# EAGLE design Light_Barrier_2015_3 (EAGLE 7.3.0)
Assembly variants: X4

## Sheet 1 of 3
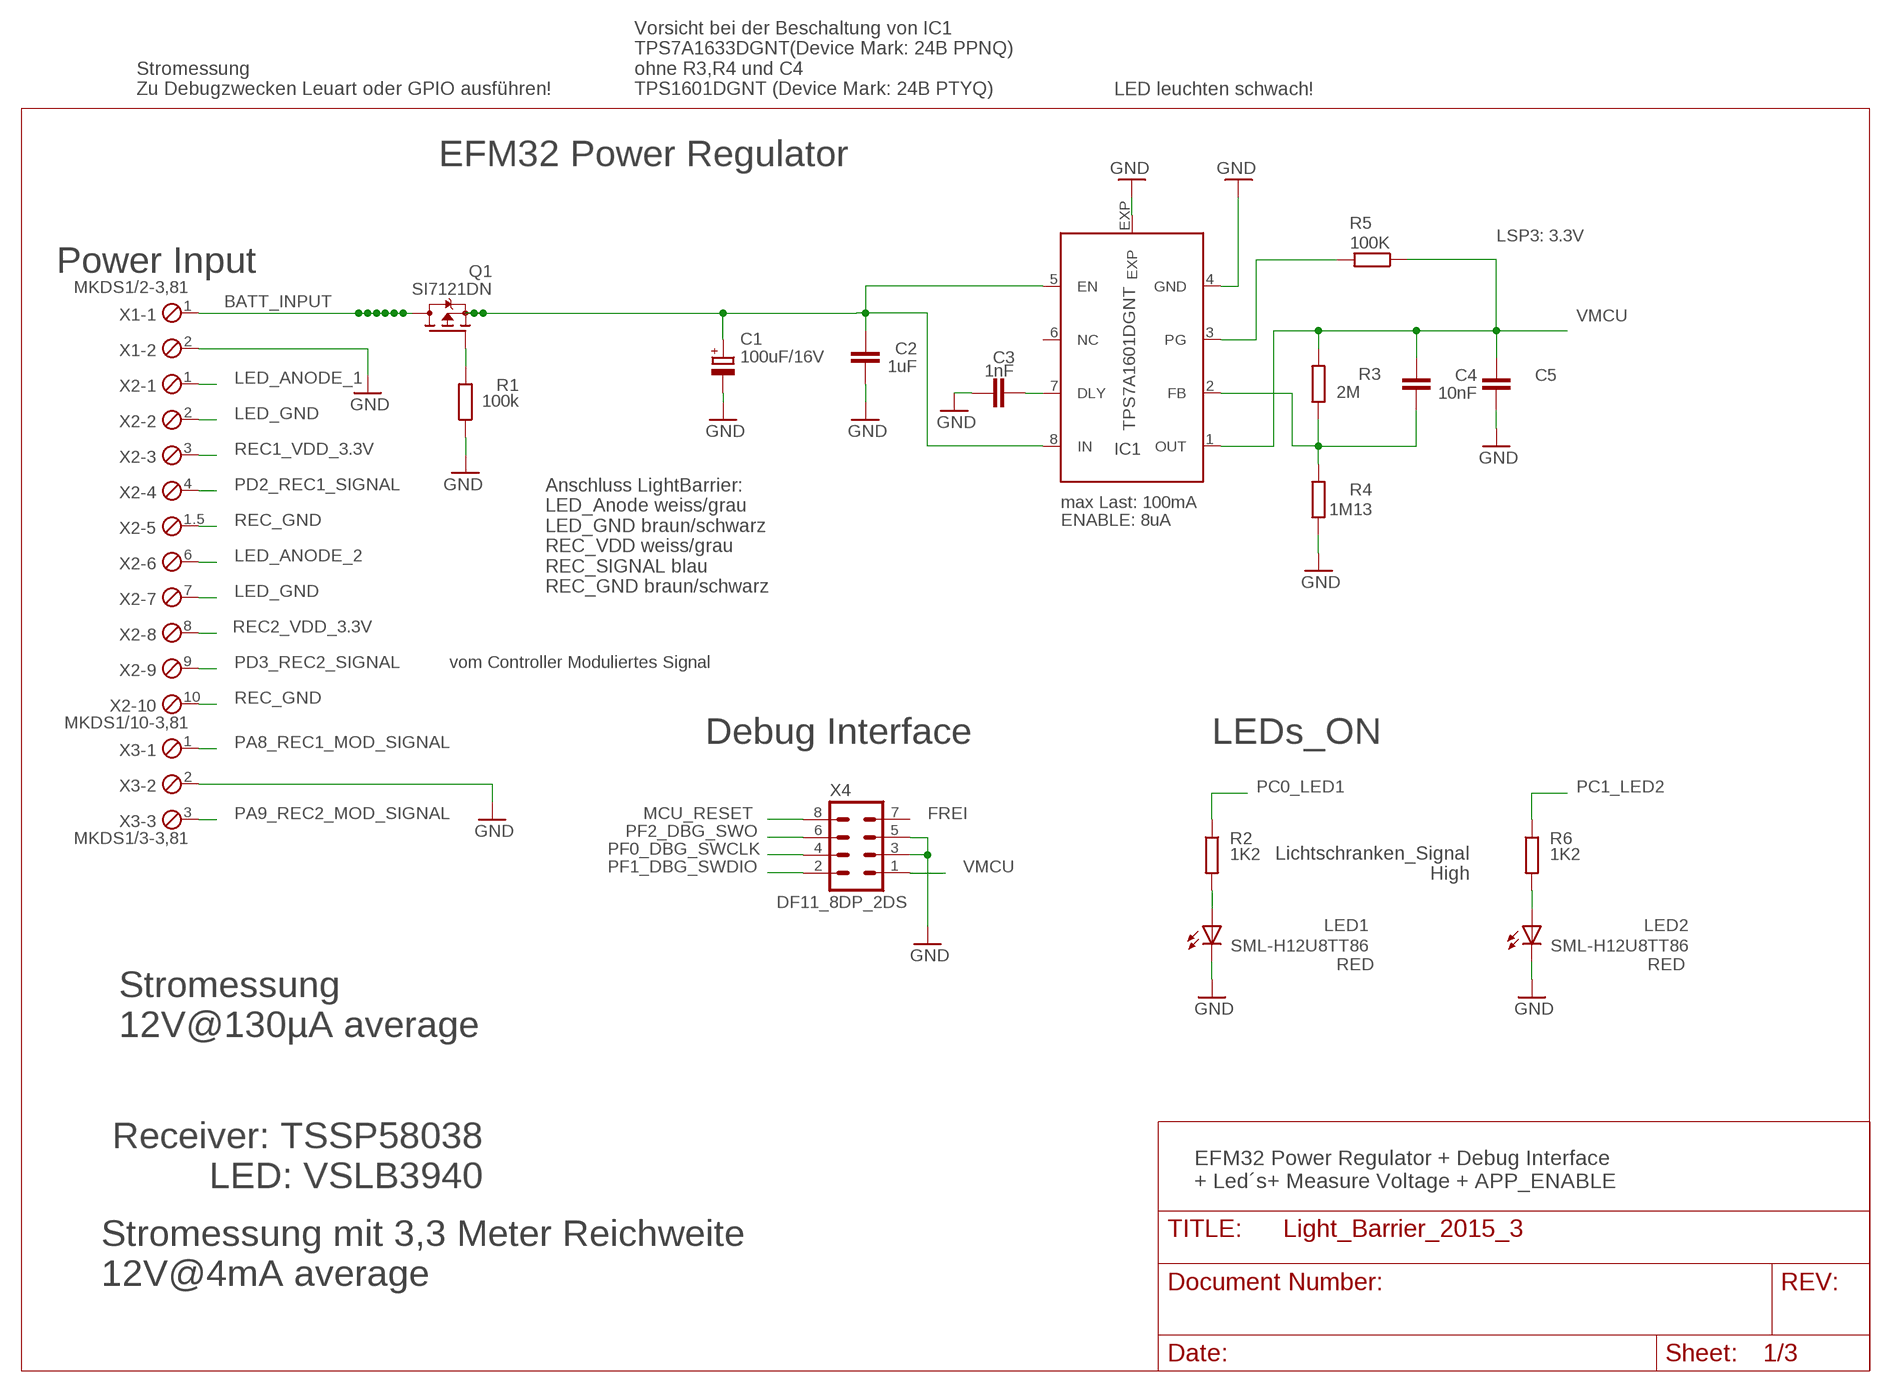
[diagram p0: schematic, sheet 1]

### Parts
C1  100uF/16V  CPOL-EUE  [PANASONIC_E]
C2  1uF  C-EUC0603  [C0603]
C3  1nF  C-EUC0603  [C0603]
C4  10nF  C-EUC0603  [C0603]
C5  10uF  C-EUC1206  [C1206]
IC1  TPS7A1601DGNT  TPS7A16  [DGN_S-PDSO-G8-EXP]
LED1  SML-H12U8TT86  LEDCHIPLED_0805  [CHIPLED_0805]
LED2  SML-H12U8TT86  LEDCHIPLED_0805  [CHIPLED_0805]
Q1  SI7121DN  TRANSISTOR-FET_SI7113DN  [TRANSISTOR-FET_1212-8S]
R1  100k  R-EU_R0805  [R0805]
R2  1K2  R-EU_R0805  [R0805]
R3  2M  R-EU_R0805  [R0805]
R4  1M13  R-EU_R0805  [R0805]
R5  100K  R-EU_R0805  [R0805]
R6  1K2  R-EU_R0805  [R0805]
X1  MKDS1/2-3,81  [2POL381]
X2  MKDS1/10-3,81  [10POL381]
X3  MKDS1/3-3,81  [3POL381]
X4  DF11_8DP_2DS  DP11_8DP_2DS  [DP11_8DP-2DS]

### Nets
BATT_INPUT: Q1.5(D) Q1.6(D) Q1.7(D) Q1.8(D) Q1.9(D) Q1.10(D) Q1.11(D) X1.1
GND: C1.- C2.1 C3.1 C5.1 IC1.4(GND) IC1.EXP LED1.C LED2.C R1.1 R4.1 X1.2 X3.2 X4.3 X4.5 ; also sheet 2,3
LED_ANODE_1: X2.1 ; also sheet 3
LED_ANODE_2: X2.6 ; also sheet 3
LED_GND: X2.2 X2.7 ; also sheet 3
MCU_RESET: X4.8 ; also sheet 2
N$1: C4.1 IC1.2(FB) R3.1 R4.2
N$5: C3.2 IC1.7(DLY)
N$7: C1.+ C2.2 IC1.5(EN) IC1.8(IN) Q1.1(S) Q1.2(S) Q1.3(S)
N$9: IC1.3(PG) R5.2
N$20: Q1.4(G) R1.2
N$29: LED1.A R2.2
N$44: LED2.A R6.2
PA8_REC1_MOD_SIGNAL: X3.1 ; also sheet 2
PA9_REC2_MOD_SIGNAL: X3.3 ; also sheet 2
PC0_LED1: R2.1 ; also sheet 2
PC1_LED2: R6.1 ; also sheet 2
PD2_REC1_SIGNAL: X2.4 ; also sheet 2
PD3_REC2_SIGNAL: X2.9 ; also sheet 2
PF0_DBG_SWCLK: X4.4 ; also sheet 2
PF1_DBG_SWDIO: X4.2 ; also sheet 2
PF2_DBG_SWO: X4.6 ; also sheet 2
REC1_VDD_3.3V: X2.3 ; also sheet 3
REC2_VDD_3.3V: X2.8 ; also sheet 3
REC_GND: X2.1.5 X2.10 ; also sheet 3
VMCU: C4.2 C5.2 IC1.1(OUT) R3.2 R5.1 X4.1 ; also sheet 2,3
Unconnected: IC1.6(NC) X4.7

### Notes on the sheet
- Stromessung
  Zu Debugzwecken Leuart oder GPIO ausführen!
- Vorsicht bei der Beschaltung von IC1 
  TPS7A1633DGNT(Device Mark: 24B PPNQ)
  ohne R3,R4 und C4
  TPS1601DGNT (Device Mark: 24B PTYQ)
- LED leuchten schwach!
- EFM32 Power Regulator
- LSP3: 3.3V
- Power Input
- max Last: 100mA
- ENABLE: 8uA
- Anschluss LightBarrier:
  LED_Anode weiss/grau
  LED_GND braun/schwarz
  REC_VDD weiss/grau
  REC_SIGNAL blau
  REC_GND braun/schwarz
- vom Controller Moduliertes Signal
- Debug Interface | LEDs_ON
- FREI
- Lichtschranken_Signal
  High
- RED | RED
- Stromessung
  12V@130µA average
- Receiver: TSSP58038
  LED: VSLB3940
- EFM32 Power Regulator + Debug Interface
  + Led´s+ Measure Voltage + APP_ENABLE
- Stromessung mit 3,3 Meter Reichweite
  12V@4mA average

## Sheet 2 of 3
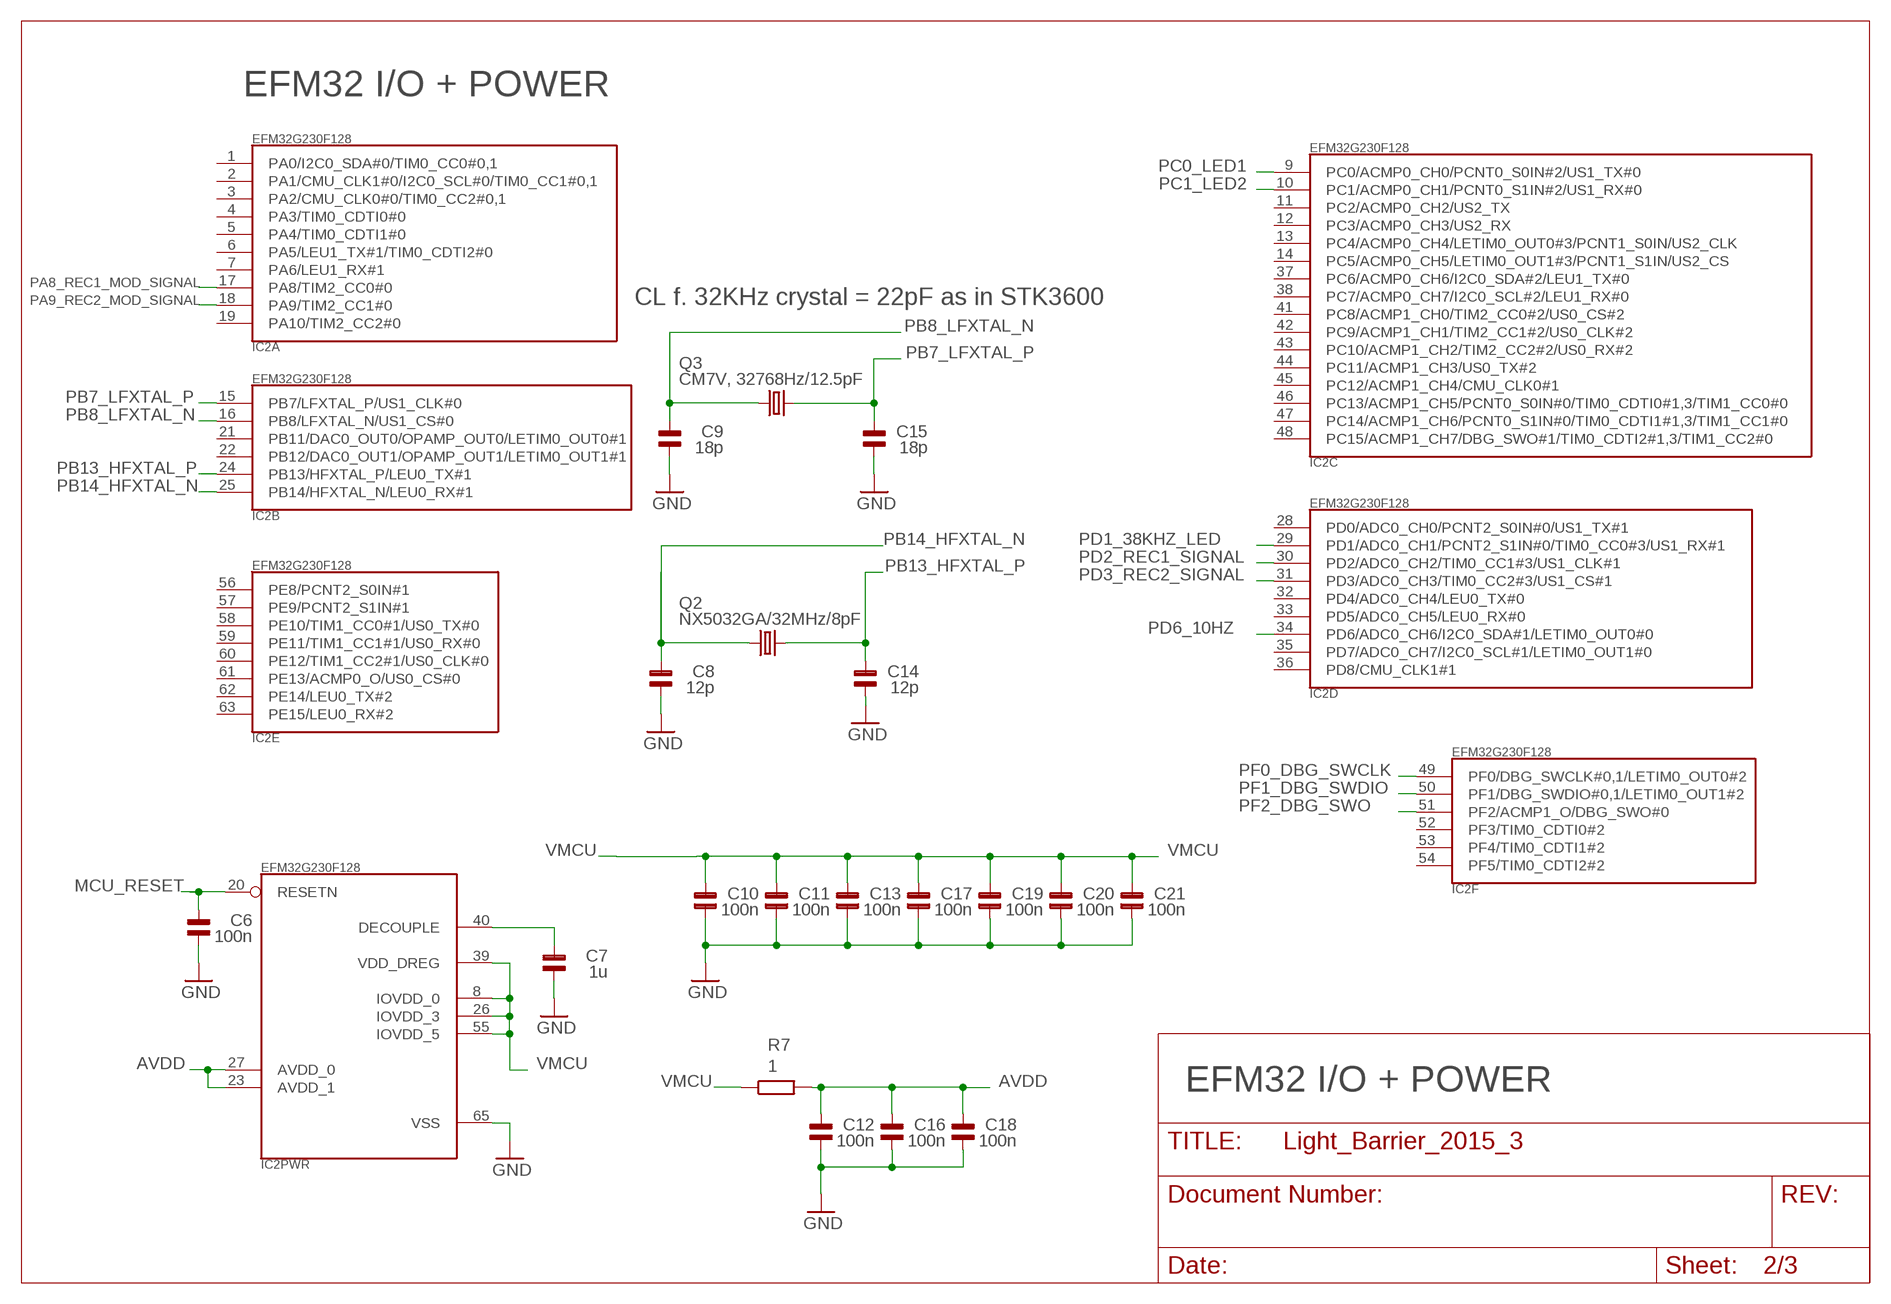
[diagram p1: schematic, sheet 2]

### Parts
C6  100n  C_SMD0805  [0805]
C7  1u  C_SMD0805  [0805]
C8  12p  C_SMD0805  [0805]
C9  18p  C_SMD0805  [0805]
C10  100n  C_SMD0805  [0805]
C11  100n  C_SMD0805  [0805]
C12  100n  C_SMD0805  [0805]
C13  100n  C_SMD0805  [0805]
C14  12p  C_SMD0805  [0805]
C15  18p  C_SMD0805  [0805]
C16  100n  C_SMD0805  [0805]
C17  100n  C_SMD0805  [0805]
C18  100n  C_SMD0805  [0805]
C19  100n  C_SMD0805  [0805]
C20  100n  C_SMD0805  [0805]
C21  100n  C_SMD0805  [0805]
IC2  EFM32G230F128  [QFN64]
Q2  NX5032GA/32MHz/8pF  CRYSTAL2P5.0X3.2  [CRYSTAL2P5.0X3.2]
Q3  CM7V, 32768Hz/12.5pF  CRYSTAL2P  [CRYSTAL2P3.2X1.5]
R7  1  R-EU_R0805  [R0805]

### Nets
AVDD [VCC]: C12.2 C16.2 C18.2 IC2.23(PWR:AVDD_1) IC2.27(PWR:AVDD_0) R7.2
GND: C6.1 C7.1 C8.1 C9.1 C10.1 C11.1 C12.1 C13.1 C14.1 C15.1 C16.1 C17.1 C18.1 C19.1 C20.1 C21.1 IC2.65(PWR:VSS) ; also sheet 1,3
MCU_RESET: C6.2 IC2.20(PWR:RESETN) ; also sheet 1
N$30: C7.2 IC2.40(PWR:DECOUPLE)
PA8_REC1_MOD_SIGNAL: IC2.17(A:PA8/TIM2_CC0#0) ; also sheet 1
PA9_REC2_MOD_SIGNAL: IC2.18(A:PA9/TIM2_CC1#0) ; also sheet 1
PB7_LFXTAL_P: C15.2 IC2.15(B:PB7/LFXTAL_P/US1_CLK#0) Q3.2
PB8_LFXTAL_N: C9.2 IC2.16(B:PB8/LFXTAL_N/US1_CS#0) Q3.1
PB13_HFXTAL_P: C14.2 IC2.24(B:PB13/HFXTAL_P/LEU0_TX#1) Q2.2
PB14_HFXTAL_N: C8.2 IC2.25(B:PB14/HFXTAL_N/LEU0_RX#1) Q2.1
PC0_LED1: IC2.9(C:PC0/ACMP0_CH0/PCNT0_S0IN#2/US1_TX#0) ; also sheet 1
PC1_LED2: IC2.10(C:PC1/ACMP0_CH1/PCNT0_S1IN#2/US1_RX#0) ; also sheet 1
PD1_38KHZ_LED: IC2.29(D:PD1/ADC0_CH1/PCNT2_S1IN#0/TIM0_CC0#3/US1_RX#1) ; also sheet 3
PD2_REC1_SIGNAL: IC2.30(D:PD2/ADC0_CH2/TIM0_CC1#3/US1_CLK#1) ; also sheet 1
PD3_REC2_SIGNAL: IC2.31(D:PD3/ADC0_CH3/TIM0_CC2#3/US1_CS#1) ; also sheet 1
PD6_10HZ: IC2.34(D:PD6/ADC0_CH6/I2C0_SDA#1/LETIM0_OUT0#0) ; also sheet 3
PF0_DBG_SWCLK: IC2.49(F:PF0/DBG_SWCLK#0,1/LETIM0_OUT0#2) ; also sheet 1
PF1_DBG_SWDIO: IC2.50(F:PF1/DBG_SWDIO#0,1/LETIM0_OUT1#2) ; also sheet 1
PF2_DBG_SWO: IC2.51(F:PF2/ACMP1_O/DBG_SWO#0) ; also sheet 1
VMCU: C10.2 C11.2 C13.2 C17.2 C19.2 C20.2 C21.2 IC2.8(PWR:IOVDD_0) IC2.26(PWR:IOVDD_3) IC2.39(PWR:VDD_DREG) IC2.55(PWR:IOVDD_5) R7.1 ; also sheet 1,3
Unconnected: IC2.1(A:PA0/I2C0_SDA#0/TIM0_CC0#0,1) IC2.2(A:PA1/CMU_CLK1#0/I2C0_SCL#0/TIM0_CC1#0,1) IC2.3(A:PA2/CMU_CLK0#0/TIM0_CC2#0,1) IC2.4(A:PA3/TIM0_CDTI0#0) IC2.5(A:PA4/TIM0_CDTI1#0) IC2.6(A:PA5/LEU1_TX#1/TIM0_CDTI2#0) IC2.7(A:PA6/LEU1_RX#1) IC2.11(C:PC2/ACMP0_CH2/US2_TX) IC2.12(C:PC3/ACMP0_CH3/US2_RX) IC2.13(C:PC4/ACMP0_CH4/LETIM0_OUT0#3/PCNT1_S0IN/US2_CLK) IC2.14(C:PC5/ACMP0_CH5/LETIM0_OUT1#3/PCNT1_S1IN/US2_CS) IC2.19(A:PA10/TIM2_CC2#0) IC2.21(B:PB11/DAC0_OUT0/OPAMP_OUT0/LETIM0_OUT0#1) IC2.22(B:PB12/DAC0_OUT1/OPAMP_OUT1/LETIM0_OUT1#1) IC2.28(D:PD0/ADC0_CH0/PCNT2_S0IN#0/US1_TX#1) IC2.32(D:PD4/ADC0_CH4/LEU0_TX#0) IC2.33(D:PD5/ADC0_CH5/LEU0_RX#0) IC2.35(D:PD7/ADC0_CH7/I2C0_SCL#1/LETIM0_OUT1#0) IC2.36(D:PD8/CMU_CLK1#1) IC2.37(C:PC6/ACMP0_CH6/I2C0_SDA#2/LEU1_TX#0) IC2.38(C:PC7/ACMP0_CH7/I2C0_SCL#2/LEU1_RX#0) IC2.41(C:PC8/ACMP1_CH0/TIM2_CC0#2/US0_CS#2) IC2.42(C:PC9/ACMP1_CH1/TIM2_CC1#2/US0_CLK#2) IC2.43(C:PC10/ACMP1_CH2/TIM2_CC2#2/US0_RX#2) IC2.44(C:PC11/ACMP1_CH3/US0_TX#2) IC2.45(C:PC12/ACMP1_CH4/CMU_CLK0#1) IC2.46(C:PC13/ACMP1_CH5/PCNT0_S0IN#0/TIM0_CDTI0#1,3/TIM1_CC0#0) IC2.47(C:PC14/ACMP1_CH6/PCNT0_S1IN#0/TIM0_CDTI1#1,3/TIM1_CC1#0) IC2.48(C:PC15/ACMP1_CH7/DBG_SWO#1/TIM0_CDTI2#1,3/TIM1_CC2#0) IC2.52(F:PF3/TIM0_CDTI0#2) IC2.53(F:PF4/TIM0_CDTI1#2) IC2.54(F:PF5/TIM0_CDTI2#2) IC2.56(E:PE8/PCNT2_S0IN#1) IC2.57(E:PE9/PCNT2_S1IN#1) IC2.58(E:PE10/TIM1_CC0#1/US0_TX#0) IC2.59(E:PE11/TIM1_CC1#1/US0_RX#0) IC2.60(E:PE12/TIM1_CC2#1/US0_CLK#0) IC2.61(E:PE13/ACMP0_O/US0_CS#0) IC2.62(E:PE14/LEU0_TX#2) IC2.63(E:PE15/LEU0_RX#2)

### Notes on the sheet
- EFM32 I/O + POWER
- CL f. 32KHz crystal = 22pF as in STK3600
- EFM32 I/O + POWER

## Sheet 3 of 3
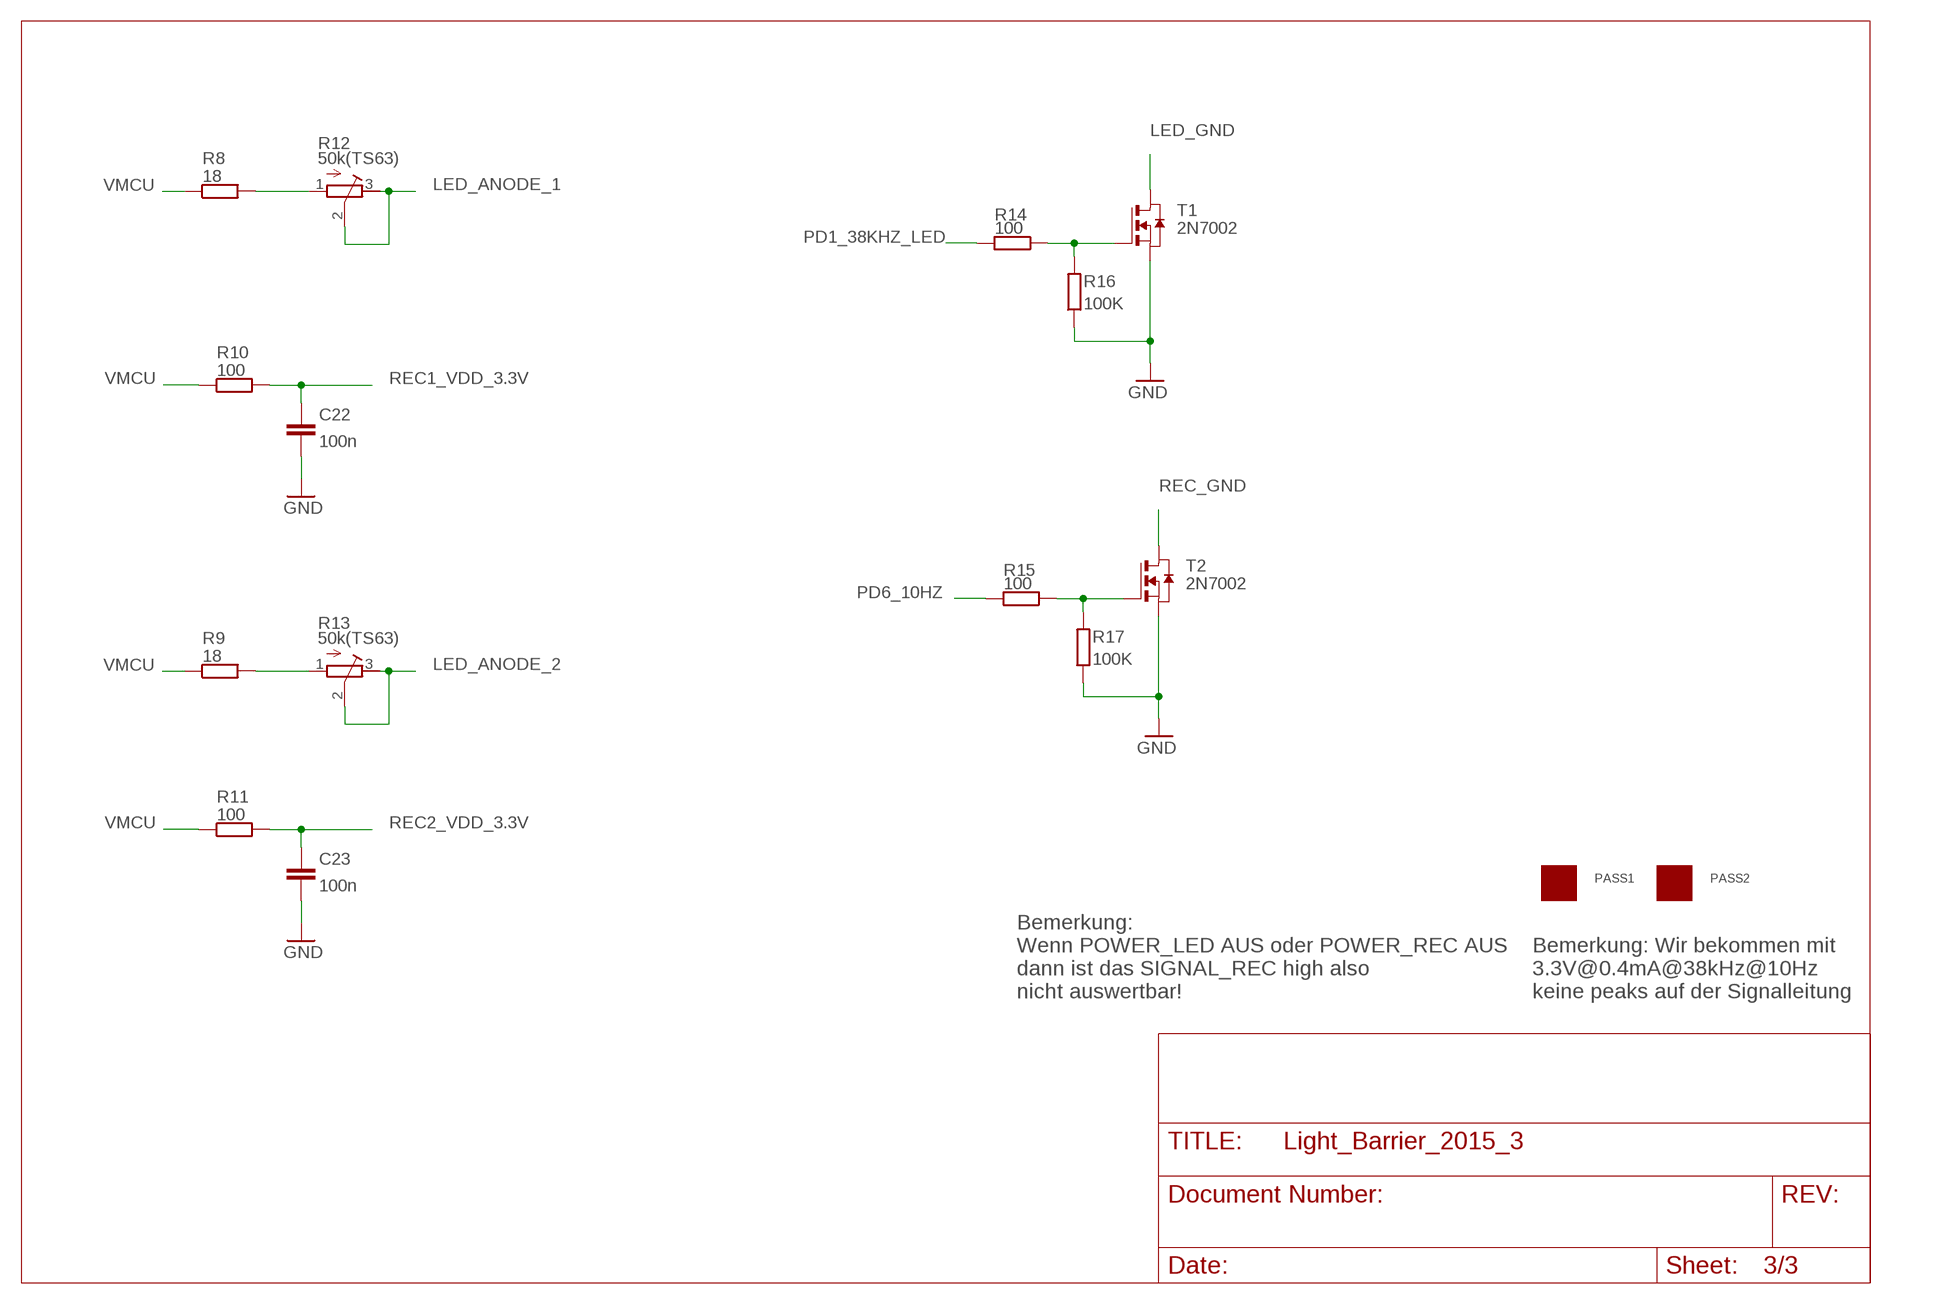
[diagram p2: schematic, sheet 3]

### Parts
C22  100n  C-EUC0805  [C0805]
C23  100n  C-EUC0805  [C0805]
PASS1  ROUND_1MM1.5  [ROUND2_1.5MM]
PASS2  ROUND_1MM1.5  [ROUND2_1.5MM]
R8  18  R-EU_R0805  [R0805]
R9  18  R-EU_R0805  [R0805]
R10  100  R-EU_R0805  [R0805]
R11  100  R-EU_R0805  [R0805]
R12  50k(TS63)  R-TRIMMTS63Y  [RTRIMTS63Y]
R13  50k(TS63)  R-TRIMMTS63Y  [RTRIMTS63Y]
R14  100  R-EU_R0805  [R0805]
R15  100  R-EU_R0805  [R0805]
R16  100K  R-EU_R0805  [R0805]
R17  100K  R-EU_R0805  [R0805]
T1  2N7002  ZETEX_NMOSSOT23  [ZETEX_SOT-23]
T2  2N7002  ZETEX_NMOSSOT23  [ZETEX_SOT-23]

### Nets
GND: C22.2 C23.2 R16.1 R17.1 T1.2(S) T2.2(S) ; also sheet 1,2
LED_ANODE_1: R12.2(S) R12.3(E) ; also sheet 1
LED_ANODE_2: R13.2(S) R13.3(E) ; also sheet 1
LED_GND: T1.1(D) ; also sheet 1
N$2: R9.2 R13.1(A)
N$13: R8.2 R12.1(A)
N$15: R14.1 R16.2 T1.3(G)
N$17: R15.1 R17.2 T2.3(G)
PD1_38KHZ_LED: R14.2 ; also sheet 2
PD6_10HZ: R15.2 ; also sheet 2
REC1_VDD_3.3V: C22.1 R10.2 ; also sheet 1
REC2_VDD_3.3V: C23.1 R11.2 ; also sheet 1
REC_GND: T2.1(D) ; also sheet 1
VMCU: R8.1 R9.1 R10.1 R11.1 ; also sheet 1,2

### Notes on the sheet
- Bemerkung:
  Wenn POWER_LED AUS oder POWER_REC AUS
  dann ist das SIGNAL_REC high also
  nicht auswertbar!
- Bemerkung: Wir bekommen mit 
  3.3V@0.4mA@38kHz@10Hz
  keine peaks auf der Signalleitung

## Library data of the parts
C1 = rcl:CPOL-EU: POLARIZED CAPACITOR, European symbol
C2-C5 = resistor:C-EU: CAPACITOR, European symbol
C6-C21 = IAR.RLC:C_SMD
C22 C23 = rcl:C-EU: CAPACITOR, European symbol
IC1 = texas_Kiermaier:TPS7A16
IC2 = EnergyMicro:EFM32G230F128: EFM32G230F128 Gecko Microcontroller in 9mm x 9mm QFN64 package
LED1 LED2 = led:LED: LED OSRAM: - CHIPLED LG R971, LG N971, LY N971, LG Q971, LY Q971, LO R971, LY R971 LH N974, LH R974 LS Q976, LO Q976, LY Q976 LO Q996 - Hyper CHIPLED LW Q18S LB Q993, LB Q99A, LB R99A - SideLED LS A670, LO A670, LY A670, LG A670, LP A670 LB A673, LV A673, LT A673, LW A673 LH A674 LY A675 LS A676, LA A676, LO A676, LY A676, LW A676 LS A679, LY A679, LG A679 - Hyper Micro SIDELED® LS Y876, LA Y876, LO Y876, LY Y876 LT Y87S - SmartLED LW L88C, LW L88S LB L89C, LB L89S, LG L890 LS L89K, LO L89K, LY L89K LS L896, LA L896, LO L896, LY L896 - TOPLED LS T670, LO T670, LY T670, LG T670, LP T670 LSG T670, LSP T670, LSY T670, LOP T670, LYG T670 LG T671, LOG T671, LSG T671 LB T673, LV T673, LT T673, LW T673 LH T674 LS T676, LA T676, LO T676, LY T676, LB T676, LH T676, LSB T676, LW T676 LB T67C, LV T67C, LT T67C, LS T67K, LO T67K, LY T67K, LW E67C LS E67B, LA E67B, LO E67B, LY E67B, LB E67C, LV E67C, LT E67C LW T67C LS T679, LY T679, LG T679 LS T770, LO T770, LY T770, LG T770, LP T770 LB T773, LV T773, LT T773, LW T773 LH T774 LS E675, LA E675, LY E675, LS T675 LS T776, LA T776, LO T776, LY T776, LB T776 LHGB T686 LT T68C, LB T68C - Hyper Mini TOPLED® LB M676 - Mini TOPLED Santana® LG M470 LS M47K, LO M47K, LY M47K Source: http://www.osram.convergy.de LUXEON: - LUMILED® LXK2-PW12-R00, LXK2-PW12-S00, LXK2-PW14-U00, LXK2-PW14-V00 LXK2-PM12-R00, LXK2-PM12-S00, LXK2-PM14-U00 LXK2-PE12-Q00, LXK2-PE12-R00, LXK2-PE12-S00, LXK2-PE14-T00, LXK2-PE14-U00 LXK2-PB12-K00, LXK2-PB12-L00, LXK2-PB12-M00, LXK2-PB14-N00, LXK2-PB14-P00, LXK2-PB14-Q00 LXK2-PR12-L00, LXK2-PR12-M00, LXK2-PR14-Q00, LXK2-PR14-R00 LXK2-PD12-Q00, LXK2-PD12-R00, LXK2-PD12-S00 LXK2-PH12-R00, LXK2-PH12-S00 LXK2-PL12-P00, LXK2-PL12-Q00, LXK2-PL12-R00 Source: www.luxeon.com KINGBRIGHT: KA-3528ASYC Source: www.kingbright.com
PASS1 PASS2 = Passermarks:ROUND_1MM
Q1 = dcdc_BB3_V0:TRANSISTOR-FET_SI7113DN
Q2 Q3 = EdM 2011:CRYSTAL2P: Quarz Crystal
R1-R6 R14-R17 = resistor:R-EU_: RESISTOR, European symbol
R7-R11 = rcl:R-EU_: RESISTOR, European symbol
R12 R13 = rcl:R-TRIMM: Trimm resistor
T1 T2 = SESA:ZETEX_NMOSSOT23: MOS FET
X1 = con-phoenix-381:MKDS1/2-3,81: MKDS 1/2-3,81 - Order No. 1727010 (RS-Online - 101-5384) Pitch: 3,81mm Number of terminals: 2 Rated Voltage: 160V Maximum load current/ cross section: 12A/1.5mm2-AWG16 Housing Interlocking: none Color: Green
X2 = con-phoenix-381:MKDS1/10-3,81: MKDS 1/10-3,81 - Order No. 1727094 Pitch: 3,81mm Number of terminals: 10 Rated Voltage: 160V Maximum load current/ cross section: 12A/1.5mm2-AWG16 Housing Interlocking: none Color: Green
X3 = con-phoenix-381:MKDS1/3-3,81: MKDS 1/3-3,81 - Order No. 1727023 (RS-Online - 101-5390) Pitch: 3,81mm Number of terminals: 3 Rated Voltage: 160V Maximum load current/ cross section: 12A/1.5mm2-AWG16 Housing Interlocking: none Color: Green
X4 = con-hirose_1:DP11_8DP_2DS

## Net classes
0 default: width 0.15 mm
1 GND: width 0.2 mm
2 VCC: width 0.25 mm

## Board
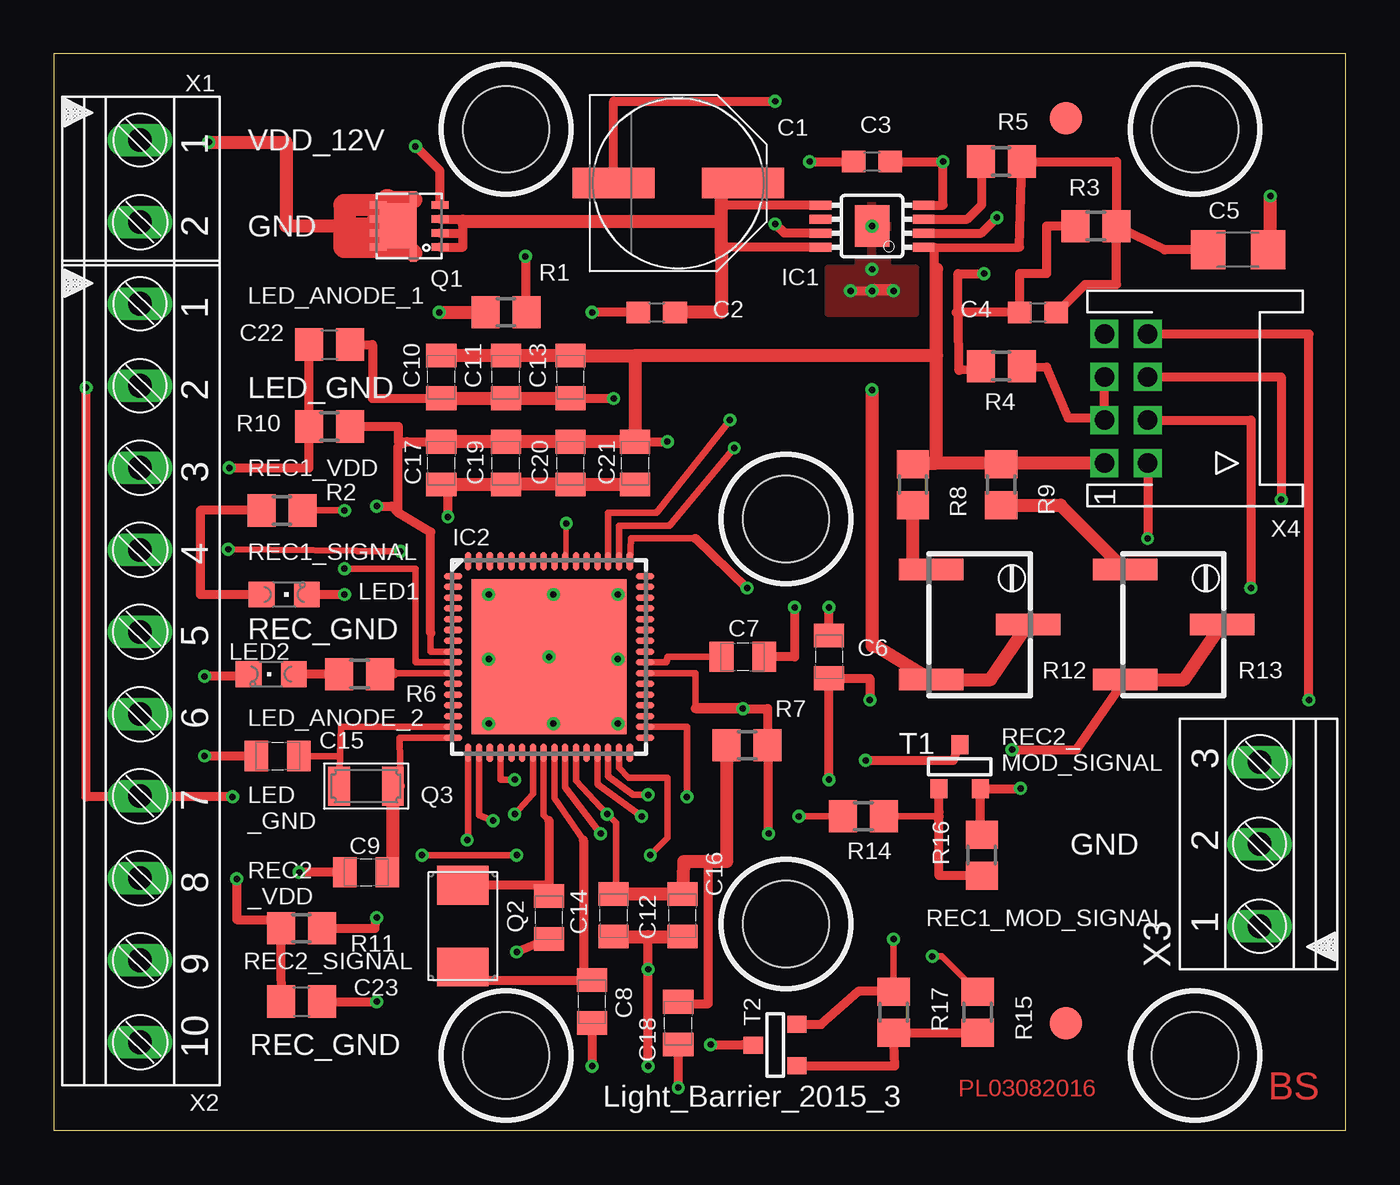
[diagram p3: board, top side]
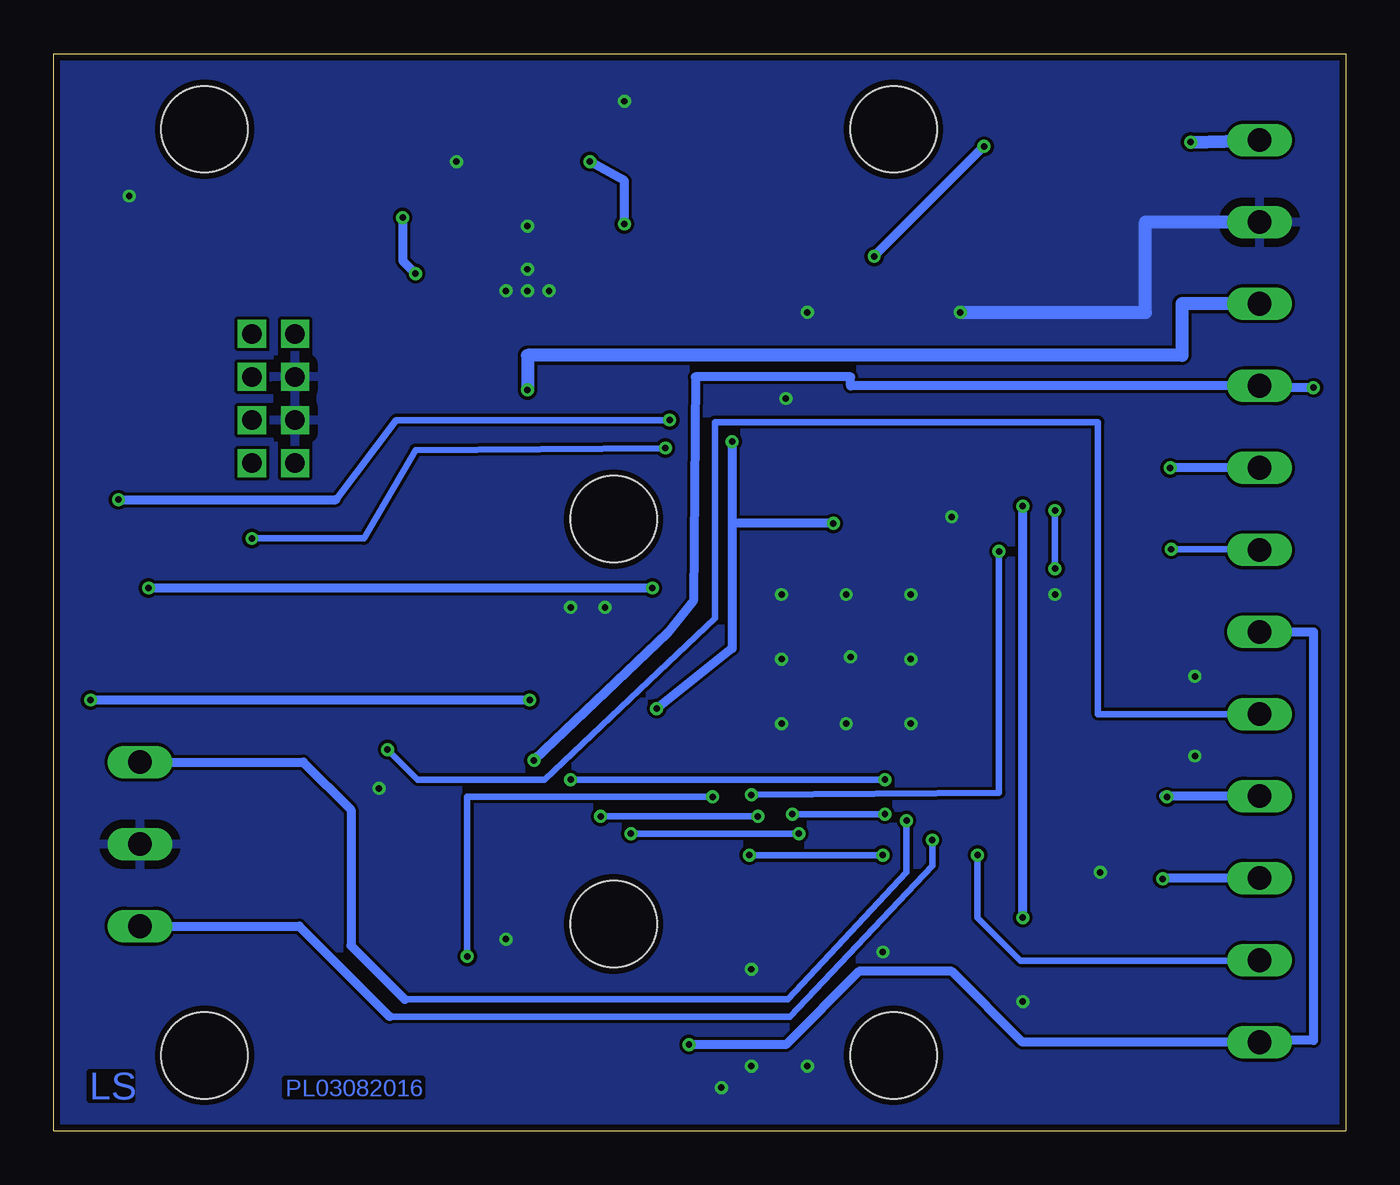
[diagram p4: board, bottom side, seen from below]

Size 60 x 50 mm. Coordinates in mm from the lower left corner, seen from the top.
Outline: 0,50 0,0 60,0 60,50 0,50
Copper layers (1+2*3+16): Top 0.035mm / dielectric 0.2mm / Route2 0.035mm / dielectric 1mm / Route3 0.035mm / dielectric 0.2mm / Bottom 0.035mm
Design rules "default *": minimum track width 0.15mm, minimum drill 0.3mm, track to track 0.15mm, track to pad 0.15mm, pad to pad 0.15mm, via to via 0.15mm, smd to smd 0mil, copper to edge 0.3mm, drill to drill 0.2mm, minimum pad ring 0.2mm, minimum via ring 0.15mm, stop-mask expansion 0.075mm, vias tented up to drill 0mil, thermal gap 0.4mm
Holes 4 mm at 21,3.5 21,46.5 53,3.5 53,46.5 34,28.4 34,9.6
bKeepout: area 0,-5.8 to 45.2,-0.3

### Footprints (pad centres in the part's own frame; a part is rotated, then mirrored left to right if it is on the bottom)
PANASONIC_E = smd 3.8 x 1.4: + 3,0; - -3,0
C0603 = smd 1.1 x 1: 1 -0.85,0; 2 0.85,0
C1206 = smd 1.6 x 1.8: 1 -1.4,0; 2 1.4,0
0805 = smd 1.092 x 1.397: 1 -0.991,0; 2 0.991,0
C0805 = smd 1.3 x 1.5: 1 -0.95,0; 2 0.95,0
DGN_S-PDSO-G8-EXP = smd 0.41 x 1.02: 1 -0.975,-2.4; 2 -0.325,-2.4; 3 0.325,-2.4; 4 0.975,-2.4; 5 0.975,2.4; 6 0.325,2.4; 7 -0.325,2.4; 8 -0.975,2.4 | smd 1.92 x 1.6: EXP 0,0
QFN64 = smd 0.85 x 0.3: 1 -4.45,3.75; 2 -4.45,3.25; 3 -4.45,2.75; 4 -4.45,2.25; 5 -4.45,1.75; 6 -4.45,1.25; 7 -4.45,0.75; 8 -4.45,0.25; 9 -4.45,-0.25; 10 -4.45,-0.75; 11 -4.45,-1.25; 12 -4.45,-1.75; 13 -4.45,-2.25; 14 -4.45,-2.75; 15 -4.45,-3.25; 16 -4.45,-3.75; 33 4.45,-3.75; 34 4.45,-3.25; 35 4.45,-2.75; 36 4.45,-2.25; 37 4.45,-1.75; 38 4.45,-1.25; 39 4.45,-0.75; 40 4.45,-0.25; 41 4.45,0.25; 42 4.45,0.75; 43 4.45,1.25; 44 4.45,1.75; 45 4.45,2.25; 46 4.45,2.75; 47 4.45,3.25; 48 4.45,3.75 | smd 0.3 x 0.85: 17 -3.75,-4.45; 18 -3.25,-4.45; 19 -2.75,-4.45; 20 -2.25,-4.45; 21 -1.75,-4.45; 22 -1.25,-4.45; 23 -0.75,-4.45; 24 -0.25,-4.45; 25 0.25,-4.45; 26 0.75,-4.45; 27 1.25,-4.45; 28 1.75,-4.45; 29 2.25,-4.45; 30 2.75,-4.45; 31 3.25,-4.45; 32 3.75,-4.45; 49 3.75,4.45; 50 3.25,4.45; 51 2.75,4.45; 52 2.25,4.45; 53 1.75,4.45; 54 1.25,4.45; 55 0.75,4.45; 56 0.25,4.45; 57 -0.25,4.45; 58 -0.75,4.45; 59 -1.25,4.45; 60 -1.75,4.45; 61 -2.25,4.45; 62 -2.75,4.45; 63 -3.25,4.45; 64 -3.75,4.45 | smd 7.2 x 7.2: 65 0,0
CHIPLED_0805 = smd 1.2 x 1.2: A 0,-1.05; C 0,1.05
ROUND2_1.5MM = smd 1.5 x 1.5: FID 0,0
TRANSISTOR-FET_1212-8S = smd 0.8 x 0.34: 1 -1.435,0.97; 2 -1.435,0.325; 3 -1.435,-0.325; 4 -1.435,-0.975; 5 1.435,-0.975; 6 1.435,-0.325; 7 1.435,0.325; 8 1.435,0.975 | smd 0.3 x 0.8: 9 -0.2,-1.225; 10 -0.2,1.25 | smd 1.7 x 2.1: 11 0.5,-0.015
CRYSTAL2P5.0X3.2 = smd 1.8 x 2.4: 1 -1.9,0; 2 1.9,0
CRYSTAL2P3.2X1.5 = smd 1 x 1.8: 1 -1.25,0; 2 1.25,0
R0805 = smd 1.3 x 1.5: 1 -0.95,0; 2 0.95,0
RTRIMTS63Y = smd 1 x 3: 1 -2.55,-2.25; 2 0,2.25; 3 2.55,-2.25
ZETEX_SOT-23 = smd 0.787 x 0.889: 1 0.025,-1.016; 2 -0.94,1.016; 3 0.991,1.016
2POL381 = drill 1.1 long: 1 0,0; 2 3.81,0
10POL381 = drill 1.1 long: 1 0,0; 1.5 15.24,0; 2 3.81,0; 3 7.62,0; 4 11.43,0; 6 19.05,0; 7 22.86,0; 8 26.67,0; 9 30.48,0; 10 34.29,0
3POL381 = drill 1.1 long: 1 0,0; 2 3.81,0; 3 7.62,0
DP11_8DP-2DS = drill 0.9 square: 1 3,-9.2; 2 3,-7.2; 3 1,-9.2; 4 1,-7.2; 5 -1,-9.2; 6 -1,-7.2; 7 -3,-9.2; 8 -3,-7.2

### Placement (x,y rotation side)
C1  29,44 0 top
C2  28,38 0 top
C3  38,45 180 top
C4  45.7,38 0 top
C5  55,40.9 180 top
C6  36,22 270 top
C7  32,22 180 top
C8  25,6 90 top
C9  14.5,12 0 top
C10  18,35 90 top
C11  21,35 90 top
C12  26,10 90 top
C13  24,35 90 top
C14  23,9.9 90 top
C15  10.4,17.4 0 top
C16  29.2,10 90 top
C17  18,31 90 top
C18  29,5 90 top
C19  21,31 90 top
C20  24,31 90 top
C21  27,31 90 top
C22  12.8,36.5 0 top
C23  11.5,6 0 top
IC1  38,42 90 top
IC2  23,22 0 top
LED1  10.7,24.9 270 top
LED2  10.1,21.2 90 top
PASS1  47,5 90 top
PASS2  47,47 90 top
Q1  16.5,42 180 top
Q2  19,9.5 90 top
Q3  14.5,16 180 top
R1  21,38 0 top
R2  10.6,28.8 180 top
R3  48.4,42 0 top
R4  44,35.5 180 top
R5  44,45 180 top
R6  14.2,21.2 180 top
R7  32.2,17.9 180 top
R8  39.9,30 270 top
R9  44,30 270 top
R10  12.8,32.7 180 top
R11  11.5,9.4 180 top
R12  43,23.5 270 top
R13  52,23.5 270 top
R14  37.6,14.6 180 top
R15  42.9,5.5 90 top
R16  43.1,12.8 270 top
R17  39,5.5 270 top
T1  42.1,16.9 180 top
T2  33.5,4 270 top
X1  4,46 270 top
X2  4,38.4 270 top
X3  56,9.5 90 top
X4  58,34 270 top

### Tracks (layer width: path | path; a pad name or v marks a point on that pad's centre or on a via)
AVDD  (via drill 0.3)
  Top 0.305: IC2.27 24.25,16.25 v25.7,14.7 | C12.2 26.1,11.39 26.1,14.3 v25.7,14.7 | IC2.23 22.25,15.65 v21.4,14.7 | v25.7,14.7 25.65,14.65
  Top 0.406: C18.2 29,5.9 30.4,5.9 30.4,12.4 30.5,12.5
  Top 0.61: R7.2 31.25,12.5 30.5,12.5 29.25,12.5 C16.2 C12.2
  Bottom 0.305: v21.4,14.7 v25.7,14.7
BATT_INPUT  (via drill 0.3)
  Top 0.61: 13.5,42 10.79,42 10.79,45.9 v7.2,45.9
  Top 0.813: Q1.11 15.5,42.02 13.5,42 | Q1.9 15.5,43.23 | Q1.10 15.9,41.55
  Top 1.016: Q1.5 13.5,42.98 13.5,42 13.5,41.02 14.5,41.02 | 14.5,41.02 Q1.8 15.06,41 16.3,41 15.9,41.55 | Q1.6 Q1.7 14.5,41.67 14.5,41.02 | 15.5,43.23 15.5,42.02
  Bottom 0.61: v7.2,45.9 X1.1
GND  (via drill 0.3)
  Top 0.305: 17.8,30.31 C17.1 | R17.1 v39,8.9
  Top 0.406: IC1.4 41.3,42.98 v41.3,45 C3.1 | C15.1 v7,17.4 | C9.1 v11.4,12 | C8.1 v25,3 | C14.1 v21.5,8.3 | C7.1 34.4,22 v34.4,24.3 | C6.1 v36,24.3 | C13.1 v26,34 | C1.- 26,47.8 v33.5,47.8 | C2.1 v25,38 | R4.1 46.1,35.45 47.1,33.1 48.8,33.1 | v37,39 v39,39 38.9,39 38.9,39.1 38.1,39.1 | C18.1 v29,2 | v27.6,3 27.6,9.01 | X4.3 48.8,33.1 | 48.8,33.1 X4.5 | C22.2 14.8,36.5 14.8,34 C10.1 | T2.2 35.64,4.94 37.4,6.5 38.95,6.5 R17.1 | C23.2 v15,6 | v18.3,28.5 18.3,29.71 C17.1 | LED1.C v13.5,24.9 | LED2.C 9.1,21.1 v7,21.1 | R16.1 43.04,13.75 T1.2 44.88,15.88 v44.9,15.9
  Top 0.61: C10.1 C11.1 C13.1 | C21.1 C20.1 C19.1 C17.1 | C12.1 27.6,9.01 C16.1 | v17.9,38 R1.1 | C5.1 56.5,41 v56.5,43.4
  Bottom 0.406: 54.9,13.3 X3.2
  Bottom 0.61: X1.2 6.21,42.19 6.21,42.2 9.3,42.2 9.3,38 v17.9,38
  other vias: 20.2,24.9 23,22 26.2,24.9 20.2,18.9 20.2,21.9 23.2,24.9 26.2,21.9 26.2,18.9 23.2,18.9 38,42 38,40 38,39 27.6,7.5
  pour Bottom: 0,50 0,0 60,0 60,50 arc-2
  pour Top: 38.7,42.9 37.4,42.9 37.4,40 36,40 36,38 40,38 40,40 38.7,40
LED_ANODE_1  (via drill 0.3)
  Top 0.61: v38,34.4 38,22.5 38.2,22.5 R12.3 43.5,20.95 R12.2
  Bottom 0.61: X2.1 7.6,38.4 7.6,36 38,36 v38,34.4
LED_ANODE_2  (via drill 0.3)
  Top 0.406: v44.5,17.7 47.5,17.7 R13.3
  Top 0.61: R13.3 52.5,20.95 R13.2
  Bottom 0.305: X2.6 11.5,19.35 11.5,32.9 29.3,32.9 29.3,23.8 37.2,16.3 43.1,16.3 v44.5,17.7
LED_GND  (via drill 0.3)
  Top 0.406: v37.7,17.2 41.77,17.2 T1.1 | v8.3,15.5 1.5,15.5 v1.5,34.5
  Bottom 0.406: v37.7,17.2 31.5,23.1 30.3,24.6 30.2,35 23,35 23,34.59 X2.2 4,34.5 v1.5,34.5 | X2.7 8.46,15.54 v8.3,15.5
MCU_RESET  (via drill 0.3)
  Top 0.305: IC2.20 20.75,16.3 v21.4,16.3 | C6.2 35.81,21.01
  Top 0.406: X4.8 58.29,37 v58.29,20 | v36,16.3 C6.2 37.9,21.01 v37.9,20
  Bottom 0.305: v21.4,16.3 v36,16.3
  Bottom 0.406: v37.9,20 v58.29,20
N$1  (via drill 0.3)
  Top 0.406: IC1.2 43.08,41.67 v43.8,42.4 | R4.2 43.15,35.35 42.04,35.3 42.01,37.89 | R3.1 46.1,42 46.1,39.8 44.85,39.8 C4.1 41.91,38 42.01,37.89 | 42.01,37.89 42,37.89 42,39.8 v43.2,39.8
  Bottom 0.406: v43.8,42.4 43.8,40.4 v43.2,39.8
N$2
  Top 0.61: R9.2 46.75,29.05 R13.1
N$5  (via drill 0.3)
  Top 0.406: IC1.7 33.92,41.67 v33.5,42.1 | v35.1,45 C3.2
  Bottom 0.406: v33.5,42.1 33.5,44.1 v35.1,45
N$7
  Top 0.406: IC1.5 31,42.98 31,44 | IC1.8 31,41.02 31,40.8 | Q1.3 19,42.33 19,42.23 19,41.67 | Q1.2 19,41.67 | Q1.1 19,41.03 19,41.67
  Top 0.61: 19,42.23 31,42.23 | 31,42.23 31,40.8 31,38 C2.2 | 31,42.23 31,44 C1.+
N$9
  Top 0.406: IC1.3 42.42,42.33 43.1,43 43.1,44.95 R5.2
N$13
  Top 0.61: R12.1 39.9,26.05 R8.2
N$15
  Top 0.305: R14.1 41.01,14.6
  Top 0.406: 41.01,14.6 41.11,14.6 | 41.11,14.6 41.11,14.8 T1.3 | R16.2 41.11,11.85 41.11,14.6
N$17
  Top 0.406: T2.3 39.06,3.01 R17.2 R15.1
N$20  (via drill 0.3)
  Top 0.406: Q1.4 17.93,44.56 v16.8,45.7 | v21.9,40.6 21.9,38.25 R1.2
  Bottom 0.406: v16.8,45.7 v21.9,40.6
N$29
  Top 0.406: R2.2 6.8,28.8 6.8,24.9 LED1.A
N$30
  Top 0.305: IC2.40 28.45,21.75 28.5,22 C7.2
N$44
  Top 0.406: R6.2 LED2.A
PA8_REC1_MOD_SIGNAL  (via drill 0.3)
  Top 0.305: IC2.17 19.25,13.65 v19.2,13.5
  Bottom 0.305: v19.2,13.5 19.2,12.3 25.8,5.3 44.4,5.3
  Bottom 0.406: X3.1 48.6,9.5 44.4,5.3
PA9_REC2_MOD_SIGNAL  (via drill 0.3)
  Top 0.305: IC2.18 19.75,14.65 v20.4,14.4
  Bottom 0.305: v20.4,14.4 20.4,12 25.9,6.1 43.7,6.1
  Bottom 0.406: X3.3 48.42,17.12 46.2,14.9 46.2,8.6 43.7,6.1
PB7_LFXTAL_P
  Top 0.305: IC2.15 13.34,18.75 13.29,17.48 | Q3.2 13.29,17.48 | C15.2 13.22,17.4 13.29,17.48
PB8_LFXTAL_N
  Top 0.305: IC2.16 16.05,18.25 16.1,16
  Top 0.406: 16.1,16 Q3.1
  Top 0.61: C9.2 15.75,12 Q3.1
PB13_HFXTAL_P
  Top 0.305: IC2.24 22.75,14.65 23,14.4
  Top 0.406: Q2.2 22.99,11.39 C14.2 23,14.4
PB14_HFXTAL_N
  Top 0.305: IC2.25 23.25,15.45 24.6,13.5
  Top 0.406: 24.6,13.5 24.6,6.99 C8.2 19.2,7 19.2,8 Q2.1
PC0_LED1  (via drill 0.3)
  Top 0.305: v13.5,28.8 R2.1 | IC2.9 16.8,21.75 16.8,26.1 v13.5,26.1
  Bottom 0.305: v13.5,26.1 v13.5,28.8
PC1_LED2
  Top 0.305: IC2.10 15.8,21.25
  Top 0.406: R6.1 15.8,21.2 15.8,21.25
PD1_38KHZ_LED  (via drill 0.3)
  Top 0.305: IC2.29 25.25,16.1 v27.3,14.6 | v34.6,14.6 R14.2
  Bottom 0.305: v27.3,14.6 v34.6,14.6
PD2_REC1_SIGNAL  (via drill 0.3)
  Top 0.305: IC2.30 25.75,16.45 26.9,15.6 v27.6,15.6 | v8.1,27 v16.1,26.9 14.1,26.9
  Bottom 0.305: v27.6,15.6 16.1,15.7 v16.1,26.9 | v8.1,27 4,27 X2.4
PD3_REC2_SIGNAL  (via drill 0.3)
  Top 0.305: IC2.31 26.25,16.85 26.7,16.4 28.5,16.4 28.5,13.6 v27.7,12.8 | v21.5,12.8 v17.1,12.8
  Bottom 0.305: v27.7,12.8 v21.5,12.8 | v17.1,12.8 17.1,9.9 15.1,7.9 4.02,7.9 X2.9
PD6_10HZ  (via drill 0.3)
  Top 0.305: IC2.34 29.4,18.75 v29.4,15.5 | v40.8,8.1 41.25,8.1 R15.2
  Bottom 0.305: v29.4,15.5 40.8,15.5 v40.8,8.1
PF0_DBG_SWCLK  (via drill 0.3)
  Top 0.305: IC2.49 26.8,27.5 29.8,27.5
  Top 0.406: X4.4 55.6,33 v55.6,25.2 | 29.8,27.5 v32.2,25.2
  Bottom 0.406: v32.2,25.2 v55.6,25.2
PF1_DBG_SWDIO  (via drill 0.3)
  Top 0.305: IC2.50 26.25,28.1 28.6,28.1 v31.6,31.7
  Top 0.406: X4.2 v50.8,27.5
  Bottom 0.305: v31.6,31.7 43.2,31.6 45.6,27.5 v50.8,27.5
PF2_DBG_SWO  (via drill 0.3)
  Top 0.305: IC2.51 25.75,28.7 28,28.7 v31.4,33
  Top 0.406: X4.6 57,35 v57,29.3
  Bottom 0.305: v31.4,33 44.1,33 46.9,29.3
  Bottom 0.406: v57,29.3 46.9,29.3
REC1_VDD_3.3V  (via drill 0.3)
  Top 0.406: R10.2 C22.1 | R10.2 11.85,32.5 | v8.15,30.78 11.85,30.78 R10.2
  Bottom 0.406: X2.3 v8.15,30.78
REC2_VDD_3.3V  (via drill 0.3)
  Top 0.406: v8.5,11.7 8.5,9.8 10.5,9.8 | R11.2 10.5,9.8 | 10.5,9.8 C23.1
  Bottom 0.406: X2.8 8.5,11.73 v8.5,11.7
REC_GND  (via drill 0.3)
  Top 0.406: v30.5,4 32.01,4 T2.1
  Bottom 0.406: v30.5,4 26,4 22.6,7.4 18.3,7.4 15.01,4.11 X2.10 4,4.2 1.5,4.2 1.5,23.16 X2.1.5
VMCU  (via drill 0.3)
  Top 0.254: IC2.55 23.8,26.45 v23.8,28.2
  Top 0.305: IC2.8 17.5,22.25 17.5,23.1 | IC2.26 23.75,15.95 v25.4,13.8 | 33.2,17.85 R7.1 | 29.8,19.7 29.8,19.6 | IC2.39 29.8,21.25 29.8,19.7 | 29.8,19.7 32,19.7 v32,19.6
  Top 0.406: IC1.1 40.9,41 | 40.9,41 44.85,41.02 R5.1 49.35,45 R3.2 | C5.2 51.6,40.9 R3.2 | v33.2,13.8 33.2,17.85 | C4.2 46.7,38.1 47.9,39.3 49.35,39.3 R3.2 | 29.8,19.6 v32,19.6 33.15,19.6 R7.1 | 41,40 40.9,40 40.9,41 | 16.4,32 16,32 16,32.7 R10.1 | 16.4,32 17.91,32 C17.2 | C20.2 v28.5,32 | 17.5,23.1 17.5,27.8 16,28.7 | 16,28.7 16,31.8 16.4,32 | R11.1 14.9,9.4 v15,9.9 | v15,29 15.7,29 16,28.7
  Top 0.61: C10.2 C11.2 C13.2 27,35.99 | C17.2 C19.2 C20.2 C21.2 27,35.99 | 41,36 27,36 27,35.99 | 41,36 41,40 | X4.1 44,31 | 44,31 41,31 | 41,31 41,36 | R8.1 40,31 41,31 | R9.1 44,31
  Bottom 0.305: v25.4,13.8 v33.2,13.8
  Bottom 0.406: v28.5,32 28.5,28.2 | 28.5,28.2 28.5,22.4 v32,19.6 | v23.8,28.2 28.5,28.2 | v15,9.9 v15,29

### Text on the board
Top: PL03082016 | BS
Bottom: PL03082016 | LS
tNames: VDD_12V | GND | LED_ANODE_1 | LED_GND | REC1_VDD | REC1_SIGNAL | REC_GND | LED_ANODE_2 | REC2_ / MOD_SIGNAL | LED / _GND | GND | REC2 / _VDD | REC1_MOD_SIGNAL | REC2_SIGNAL | REC_GND | Light_Barrier_2015_3